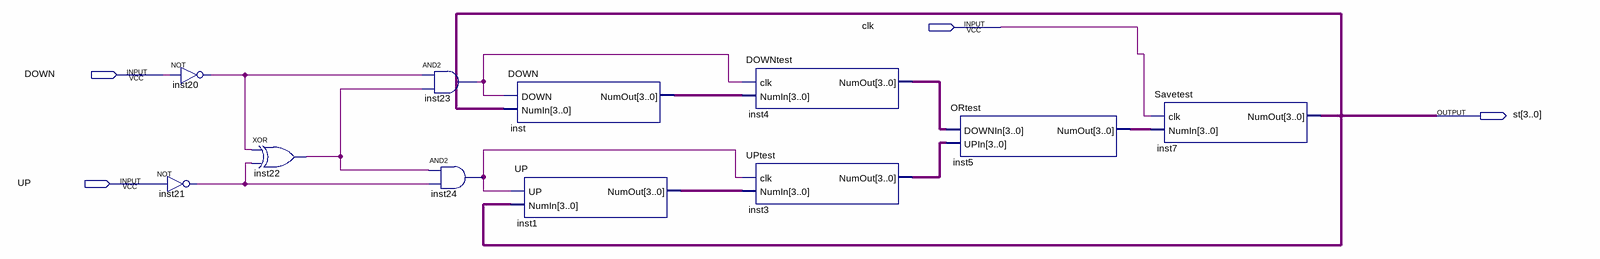
[diagram p0: schematic sheet]
// Quartus schematic UPDOWN.bdf as structural Verilog: 11 symbols, 4 pins
module UPDOWN (
  input  clk,
  input  DOWN,
  input  UP,
  output [3:0] st
);

  wire inst20_out, inst21_out, inst22_out, inst23_out, inst24_out;
  wire [3:0] inst1_numout, inst3_numout, inst4_numout, inst5_numout, inst_numout;

  not inst20 (inst20_out, DOWN);
  not inst21 (inst21_out, UP);
  xor inst22 (inst22_out, inst20_out, inst21_out);
  and inst23 (inst23_out, inst20_out, inst22_out);
  and inst24 (inst24_out, inst22_out, inst21_out);
  DOWN inst (.DOWN(inst23_out), .NumIn(st), .NumOut(inst_numout));
  UP inst1 (.UP(inst24_out), .NumIn(st), .NumOut(inst1_numout));
  DOWNtest inst4 (.clk(inst23_out), .NumIn(inst_numout), .NumOut(inst4_numout));
  UPtest inst3 (.clk(inst24_out), .NumIn(inst1_numout), .NumOut(inst3_numout));
  ORtest inst5 (.DOWNIn(inst4_numout), .UPIn(inst3_numout), .NumOut(inst5_numout));
  Savetest inst7 (.clk(clk), .NumIn(inst5_numout), .NumOut(st));
endmodule
